# EAGLE design zero_board (EAGLE 6.4)
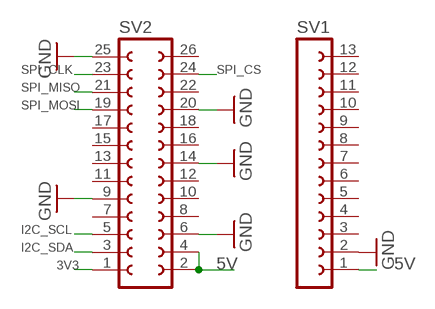
[diagram p0: schematic, sheet 1]

## Parts
SV1  FE13-1  [FE13]
SV2  FE13-2  [FE13-2]

## Nets
3V3: SV2.1
5V: SV1.1 SV2.2 SV2.4
GND: SV1.2 SV2.6 SV2.9 SV2.14 SV2.20 SV2.25
I2C_SCL: SV2.5
I2C_SDA: SV2.3
SPI_CLK: SV2.23
SPI_CS: SV2.24
SPI_MISO: SV2.21
SPI_MOSI: SV2.19
Unconnected: SV1.3 SV1.4 SV1.5 SV1.6 SV1.7 SV1.8 SV1.9 SV1.10 SV1.11 SV1.12 SV1.13 SV2.7 SV2.8 SV2.10 SV2.11 SV2.12 SV2.13 SV2.15 SV2.16 SV2.17 SV2.18 SV2.22 SV2.26

## Library data of the parts
SV1 = con-lsta:FE13-1: FEMALE HEADER; OC_FARNELL: unknown; OC_NEWARK: unknown
SV2 = con-lsta:FE13-2: FEMALE HEADER; OC_FARNELL: unknown; OC_NEWARK: unknown

## Board
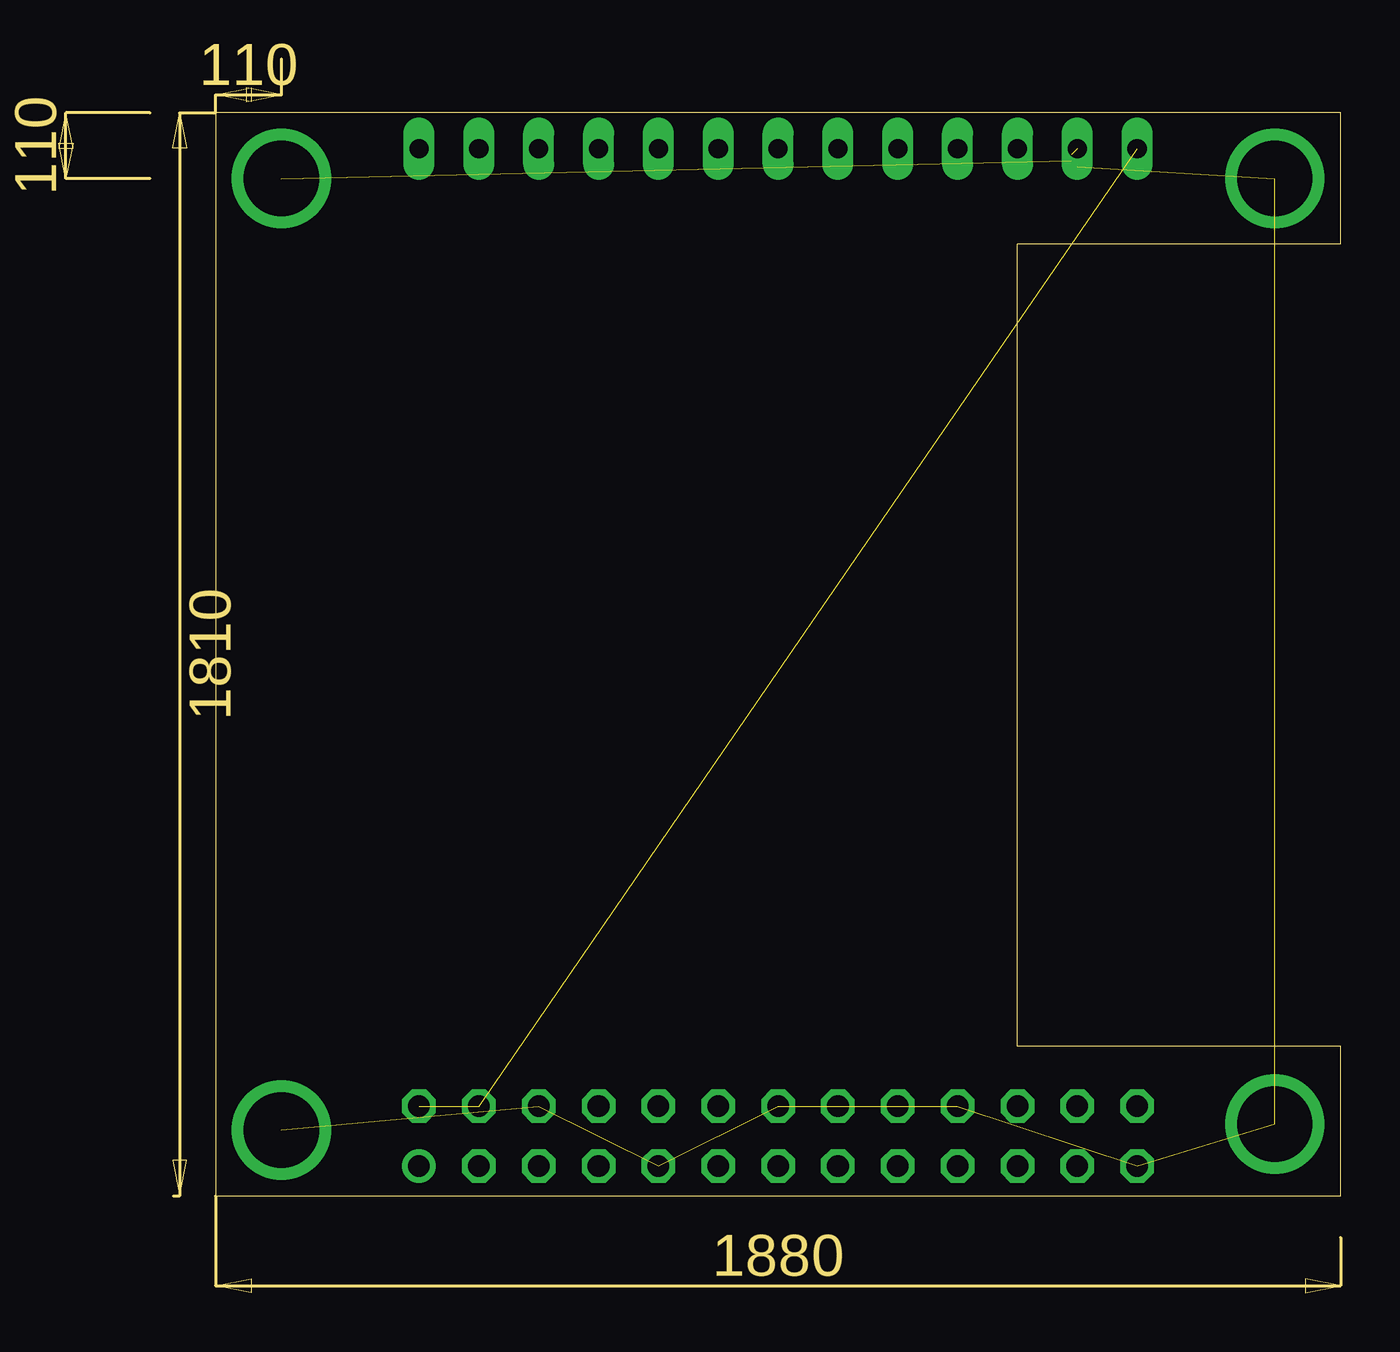
[diagram p1: board, top side]
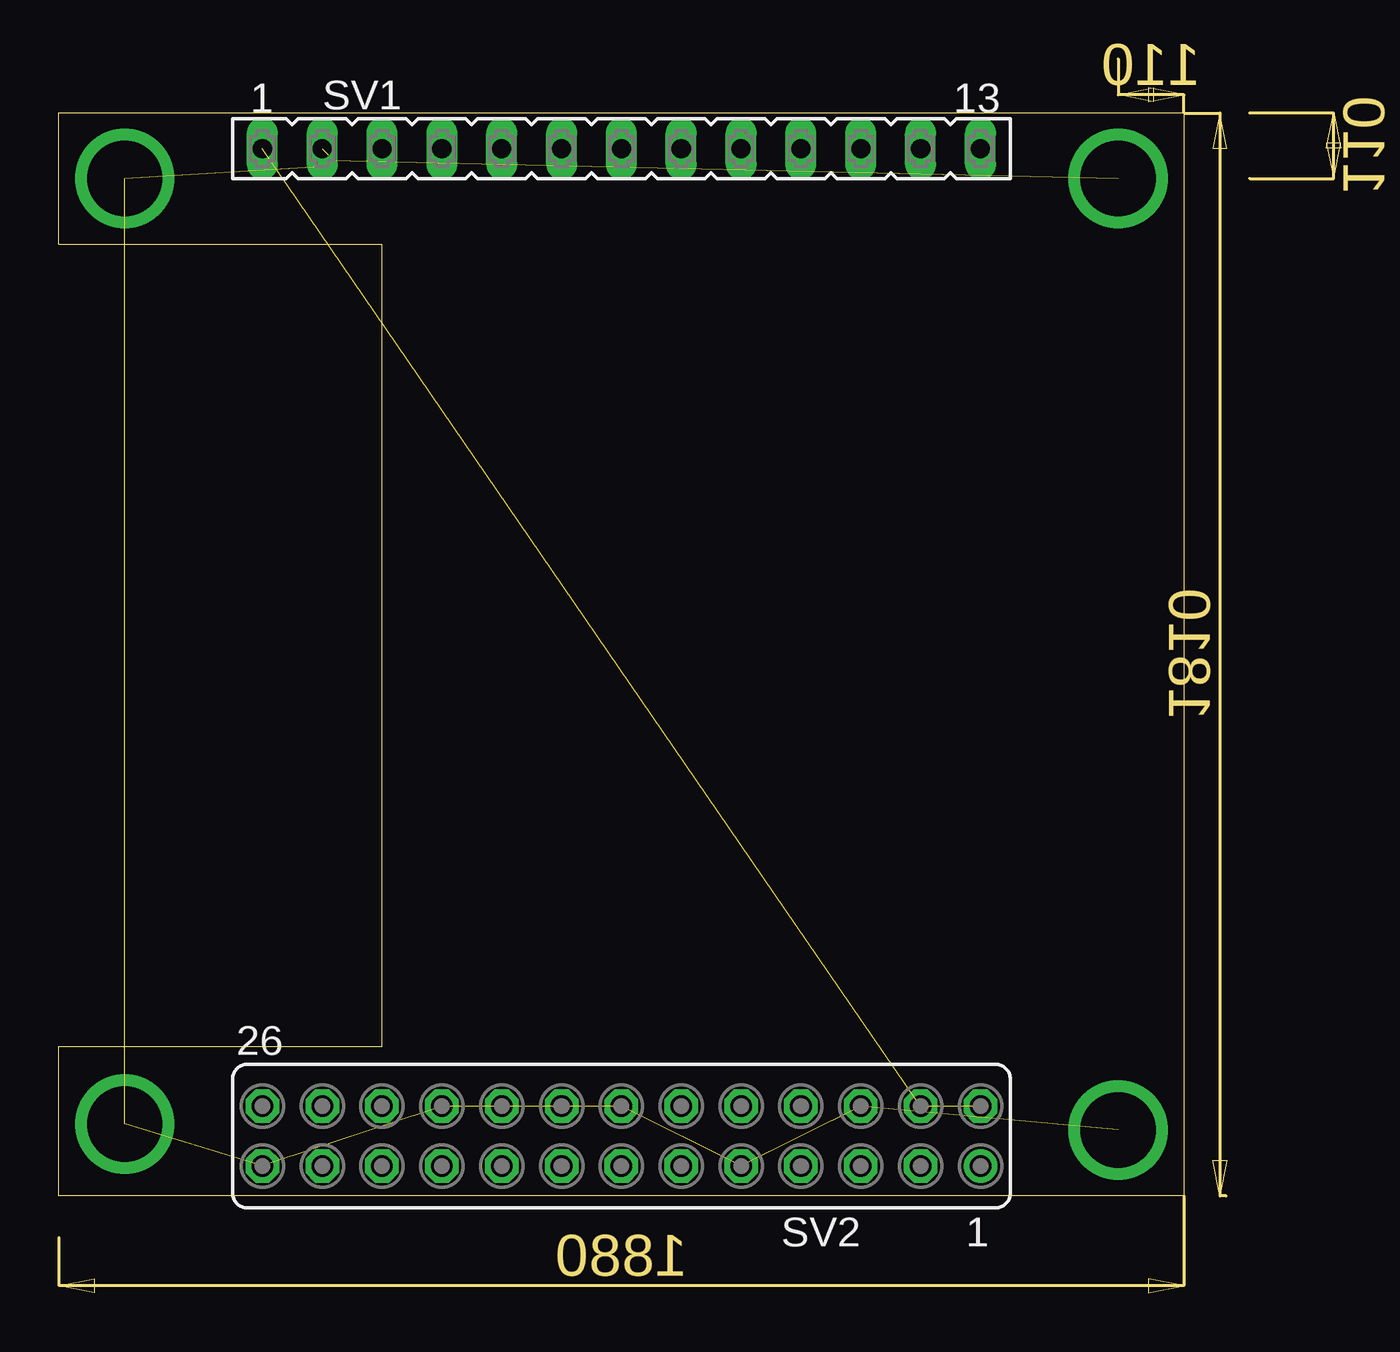
[diagram p2: board, bottom side, seen from below]

Size 47.75 x 45.97 mm. Coordinates in mm from the lower left corner, seen from the top.
Outline: 0,45.96 0,0 47.75,0 47.75,6.35 34.04,6.35 34.04,40.39 47.75,40.39 47.75,45.97 0,45.97
Copper layers (1*16): Top 0.035mm / dielectric 1.5mm / Bottom 0.035mm
Design rules "default": minimum track width 10mil, minimum drill 24mil, track to track 8mil, track to pad 8mil, pad to pad 8mil, via to via 8mil, smd to smd 8mil, copper to edge 40mil, drill to drill 8mil, minimum pad ring 10mil, minimum via ring 8mil, stop-mask expansion 4mil, vias tented up to drill 0mil, thermal gap 10mil

### Footprints (pad centres in the part's own frame; a part is rotated, then mirrored left to right if it is on the bottom)
FE13 = drill 0.813 long: 1 -15.24,0; 2 -12.7,0; 3 -10.16,0; 4 -7.62,0; 5 -5.08,0; 6 -2.54,0; 7 0,0; 8 2.54,0; 9 5.08,0; 10 7.62,0; 11 10.16,0; 12 12.7,0; 13 15.24,0
FE13-2 = drill 0.914: 1 -15.24,1.27 | drill 0.914 octagon: 2 -15.24,-1.27; 3 -12.7,1.27; 4 -12.7,-1.27; 5 -10.16,1.27; 6 -10.16,-1.27; 7 -7.62,1.27; 8 -7.62,-1.27; 9 -5.08,1.27; 10 -5.08,-1.27; 11 -2.54,1.27; 12 -2.54,-1.27; 13 0,1.27; 14 0,-1.27; 15 2.54,1.27; 16 2.54,-1.27; 17 5.08,1.27; 18 5.08,-1.27; 19 7.62,1.27; 20 7.62,-1.27; 21 10.16,1.27; 22 10.16,-1.27; 23 12.7,1.27; 24 12.7,-1.27; 25 15.24,1.27; 26 15.24,-1.27

### Placement (x,y rotation side)
SV1  23.88,44.45 0 bottom
SV2  23.88,2.54 180 bottom

### Tracks (layer width: path | path; a pad name or v marks a point on that pad's centre or on a via)
5V  (2 unrouted)
GND  (via drill 3.2)  (10 unrouted)
  Bottom 0.406: 36.58,43.69 36.32,43.94 36.32,44.2
  other vias: 2.79,2.79 44.96,3.05 2.79,43.18 44.96,43.18